# EAGLE design TestBed (EAGLE 6.5.0)
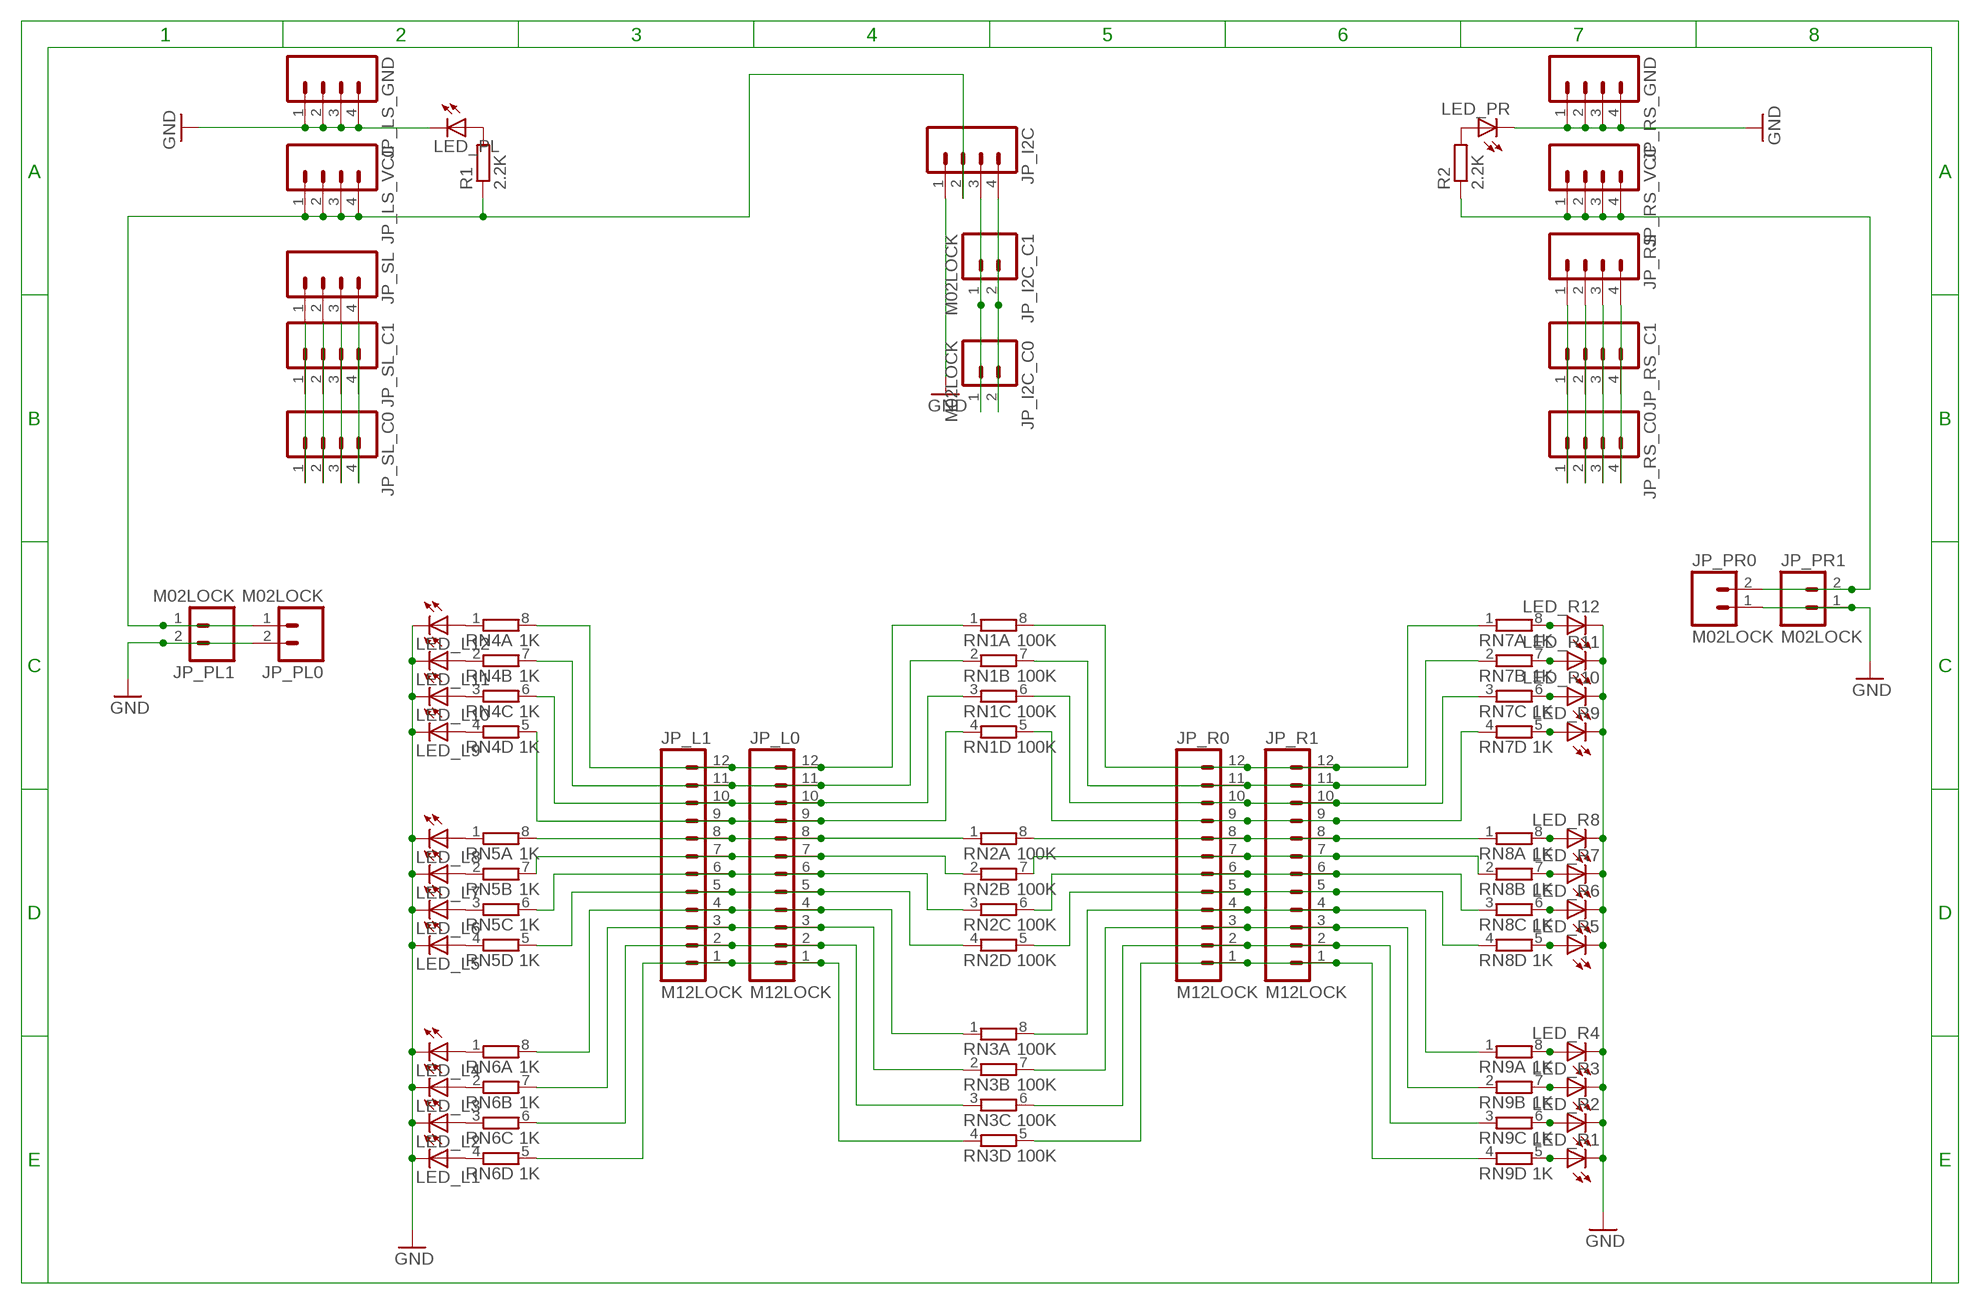
[diagram p0: schematic, sheet 1]

## Parts
JP_I2C  M04LOCK  [1X04_LOCK]
JP_I2C_C0  M02LOCK  [1X02_LOCK]
JP_I2C_C1  M02LOCK  [1X02_LOCK]
JP_L0  M12LOCK  [1X12_LOCK]
JP_L1  M12LOCK  [1X12_LOCK]
JP_LS_GND  M04LOCK  [1X04_LOCK]
JP_LS_VCC  M04LOCK  [1X04_LOCK]
JP_PL0  M02LOCK  [1X02_LOCK]
JP_PL1  M02LOCK  [1X02_LOCK]
JP_PR0  M02LOCK  [1X02_LOCK]
JP_PR1  M02LOCK  [1X02_LOCK]
JP_R0  M12LOCK  [1X12_LOCK]
JP_R1  M12LOCK  [1X12_LOCK]
JP_RS  M04LOCK  [1X04_LOCK]
JP_RS_C0  M04LOCK  [1X04_LOCK]
JP_RS_C1  M04LOCK  [1X04_LOCK]
JP_RS_GND  M04LOCK  [1X04_LOCK]
JP_RS_VCC  M04LOCK  [1X04_LOCK]
JP_SL  M04LOCK  [1X04_LOCK]
JP_SL_C0  M04LOCK  [1X04_LOCK]
JP_SL_C1  M04LOCK  [1X04_LOCK]
LED_L1  LEDCHIP-LED0805  [CHIP-LED0805]
LED_L2  LEDCHIP-LED0805  [CHIP-LED0805]
LED_L3  LEDCHIP-LED0805  [CHIP-LED0805]
LED_L4  LEDCHIP-LED0805  [CHIP-LED0805]
LED_L5  LEDCHIP-LED0805  [CHIP-LED0805]
LED_L6  LEDCHIP-LED0805  [CHIP-LED0805]
LED_L7  LEDCHIP-LED0805  [CHIP-LED0805]
LED_L8  LEDCHIP-LED0805  [CHIP-LED0805]
LED_L9  LEDCHIP-LED0805  [CHIP-LED0805]
LED_L10  LEDCHIP-LED0805  [CHIP-LED0805]
LED_L11  LEDCHIP-LED0805  [CHIP-LED0805]
LED_L12  LEDCHIP-LED0805  [CHIP-LED0805]
LED_PL  LEDCHIP-LED0805  [CHIP-LED0805]
LED_PR  LEDCHIP-LED0805  [CHIP-LED0805]
LED_R1  LEDCHIP-LED0805  [CHIP-LED0805]
LED_R2  LEDCHIP-LED0805  [CHIP-LED0805]
LED_R3  LEDCHIP-LED0805  [CHIP-LED0805]
LED_R4  LEDCHIP-LED0805  [CHIP-LED0805]
LED_R5  LEDCHIP-LED0805  [CHIP-LED0805]
LED_R6  LEDCHIP-LED0805  [CHIP-LED0805]
LED_R7  LEDCHIP-LED0805  [CHIP-LED0805]
LED_R8  LEDCHIP-LED0805  [CHIP-LED0805]
LED_R9  LEDCHIP-LED0805  [CHIP-LED0805]
LED_R10  LEDCHIP-LED0805  [CHIP-LED0805]
LED_R11  LEDCHIP-LED0805  [CHIP-LED0805]
LED_R12  LEDCHIP-LED0805  [CHIP-LED0805]
R1  2.2K  R-EU_M0805  [M0805]
R2  2.2K  R-EU_M0805  [M0805]
RN1  100K  4R-NEXBS8V  [EXBS8V]
RN2  100K  4R-NEXBS8V  [EXBS8V]
RN3  100K  4R-NEXBS8V  [EXBS8V]
RN4  1K  4R-NEXBS8V  [EXBS8V]
RN5  1K  4R-NEXBS8V  [EXBS8V]
RN6  1K  4R-NEXBS8V  [EXBS8V]
RN7  1K  4R-NEXBS8V  [EXBS8V]
RN8  1K  4R-NEXBS8V  [EXBS8V]
RN9  1K  4R-NEXBS8V  [EXBS8V]

## Nets
GND [pwr]: JP_I2C.1 JP_LS_GND.1 JP_LS_GND.2 JP_LS_GND.3 JP_LS_GND.4 JP_PL0.2 JP_PL1.2 JP_PR0.1 JP_PR1.1 JP_RS_GND.1 JP_RS_GND.2 JP_RS_GND.3 JP_RS_GND.4 LED_L1.C LED_L2.C LED_L3.C LED_L4.C LED_L5.C LED_L6.C LED_L7.C LED_L8.C LED_L9.C LED_L10.C LED_L11.C LED_L12.C LED_PL.C LED_PR.C LED_R1.C LED_R2.C LED_R3.C LED_R4.C LED_R5.C LED_R6.C LED_R7.C LED_R8.C LED_R9.C LED_R10.C LED_R11.C LED_R12.C
N$1: LED_L1.A RN6.4
N$2: LED_L2.A RN6.3
N$3: LED_L3.A RN6.2
N$4: LED_L4.A RN6.1
N$5: LED_L5.A RN5.4
N$6: LED_L6.A RN5.3
N$7: LED_L7.A RN5.2
N$8: LED_L8.A RN5.1
N$9: LED_L9.A RN4.4
N$10: LED_L10.A RN4.3
N$11: LED_L11.A RN4.2
N$12: LED_L12.A RN4.1
N$13: LED_R12.A RN7.8
N$14: LED_R11.A RN7.7
N$15: LED_R10.A RN7.6
N$16: LED_R9.A RN7.5
N$17: LED_R8.A RN8.8
N$18: LED_R7.A RN8.7
N$19: LED_R6.A RN8.6
N$20: LED_R5.A RN8.5
N$21: LED_R4.A RN9.8
N$22: LED_R3.A RN9.7
N$23: LED_R2.A RN9.6
N$24: LED_R1.A RN9.5
N$25: JP_L0.2 JP_L1.2 RN3.3 RN6.6
N$26: JP_L0.3 JP_L1.3 RN3.2 RN6.7
N$27: JP_L0.1 JP_L1.1 RN3.4 RN6.5
N$29: JP_L0.5 JP_L1.5 RN2.4 RN5.5
N$30: JP_L0.6 JP_L1.6 RN2.3 RN5.6
N$31: JP_L0.7 JP_L1.7 RN2.2 RN5.7
N$32: JP_L0.8 JP_L1.8 RN2.1 RN5.8
N$33: JP_L0.9 JP_L1.9 RN1.4 RN4.5
N$34: JP_R0.12 JP_R1.12 RN1.8 RN7.1
N$35: JP_L0.11 JP_L1.11 RN1.2 RN4.7
N$37: JP_R0.1 JP_R1.1 RN3.5 RN9.4
N$38: JP_R0.2 JP_R1.2 RN3.6 RN9.3
N$39: JP_R0.3 JP_R1.3 RN3.7 RN9.2
N$40: JP_R0.4 JP_R1.4 RN3.8 RN9.1
N$41: JP_R0.5 JP_R1.5 RN2.5 RN8.4
N$42: JP_R0.7 JP_R1.7 RN2.7 RN8.2
N$43: JP_SL.1 JP_SL_C0.1 JP_SL_C1.1
N$44: JP_R0.8 JP_R1.8 RN2.8 RN8.1
N$45: JP_R0.9 JP_R1.9 RN1.5 RN7.4
N$46: JP_R0.10 JP_R1.10 RN1.6 RN7.3
N$47: JP_R0.11 JP_R1.11 RN1.7 RN7.2
N$48: JP_SL.2 JP_SL_C0.2 JP_SL_C1.2
N$49: JP_L0.12 JP_L1.12 RN1.1 RN4.8
N$50: JP_SL.3 JP_SL_C0.3 JP_SL_C1.3
N$51: JP_SL.4 JP_SL_C0.4 JP_SL_C1.4
N$52: JP_L0.4 JP_L1.4 RN3.1 RN6.8
N$55: JP_RS.1 JP_RS_C0.1 JP_RS_C1.1
N$56: JP_RS.2 JP_RS_C0.2 JP_RS_C1.2
N$57: JP_RS.3 JP_RS_C0.3 JP_RS_C1.3
N$58: JP_L0.10 JP_L1.10 RN1.3 RN4.6
N$59: JP_RS.4 JP_RS_C0.4 JP_RS_C1.4
N$60: LED_PL.A R1.2
N$61: LED_PR.A R2.2
N$64: JP_R0.6 JP_R1.6 RN2.6 RN8.3
SCL: JP_I2C.4 JP_I2C_C0.2 JP_I2C_C1.2
SDA: JP_I2C.3 JP_I2C_C0.1 JP_I2C_C1.1
VCC_L [pwr]: JP_I2C.2 JP_LS_VCC.1 JP_LS_VCC.2 JP_LS_VCC.3 JP_LS_VCC.4 JP_PL0.1 JP_PL1.1 R1.1
VCC_R [pwr]: JP_PR0.2 JP_PR1.2 JP_RS_VCC.1 JP_RS_VCC.2 JP_RS_VCC.3 JP_RS_VCC.4 R2.1

## Library data of the parts
JP_I2C JP_LS_GND JP_LS_VCC JP_RS JP_RS_C0 JP_RS_C1 JP_RS_GND JP_RS_VCC JP_SL JP_SL_C0 JP_SL_C1 = SparkFun-Connectors:M04: Header 4 Standard 4-pin 0.1" header. Use with straight break away headers (SKU : PRT-00116), right angle break away headers (PRT-00553), swiss pins (PRT-00743), machine pins (PRT-00117), and female headers (PRT-00115). Molex polarized connector foot print use with SKU : PRT-08231 with associated crimp pins and housings. 1MM SMD Version SKU: PRT-10208
JP_I2C_C0 JP_I2C_C1 JP_PL0 JP_PL1 JP_PR0 JP_PR1 = SparkFun-Connectors:M02: Standard 2-pin 0.1" header. Use with - straight break away headers ( PRT-00116) - right angle break away headers (PRT-00553) - swiss pins (PRT-00743) - machine pins (PRT-00117) - female headers (PRT-00115) Molex polarized connector foot print use with: PRT-08233 with associated crimp pins and housings. 2.54_SCREWTERM for use with PRT-10571. 3.5mm Screw Terminal footprints for PRT-08084 5mm Screw Terminal footprints for use with PRT-08433
JP_L0 JP_L1 JP_R0 JP_R1 = SparkFun-Connectors:M12: Header 12 Standard 12-pin 0.1" header. Use with straight break away headers (SKU : PRT-00116), right angle break away headers (PRT-00553), swiss pins (PRT-00743), machine pins (PRT-00117), and female headers (PRT-00115).
LED_L1-LED_L12 LED_PL LED_PR LED_R1-LED_R12 = led:LED: LED OSRAM: - CHIPLED LG R971, LG N971, LY N971, LG Q971, LY Q971, LO R971, LY R971 LH N974, LH R974 LS Q976, LO Q976, LY Q976 LO Q996 - Hyper CHIPLED LW Q18S LB Q993, LB Q99A, LB R99A - SideLED LS A670, LO A670, LY A670, LG A670, LP A670 LB A673, LV A673, LT A673, LW A673 LH A674 LY A675 LS A676, LA A676, LO A676, LY A676, LW A676 LS A679, LY A679, LG A679 - Hyper Micro SIDELED® LS Y876, LA Y876, LO Y876, LY Y876 LT Y87S - SmartLED LW L88C, LW L88S LB L89C, LB L89S, LG L890 LS L89K, LO L89K, LY L89K LS L896, LA L896, LO L896, LY L896 - TOPLED LS T670, LO T670, LY T670, LG T670, LP T670 LSG T670, LSP T670, LSY T670, LOP T670, LYG T670 LG T671, LOG T671, LSG T671 LB T673, LV T673, LT T673, LW T673 LH T674 LS T676, LA T676, LO T676, LY T676, LB T676, LH T676, LSB T676, LW T676 LB T67C, LV T67C, LT T67C, LS T67K, LO T67K, LY T67K, LW E67C LS E67B, LA E67B, LO E67B, LY E67B, LB E67C, LV E67C, LT E67C LW T67C LS T679, LY T679, LG T679 LS T770, LO T770, LY T770, LG T770, LP T770 LB T773, LV T773, LT T773, LW T773 LH T774 LS E675, LA E675, LY E675, LS T675 LS T776, LA T776, LO T776, LY T776, LB T776 LHGB T686 LT T68C, LB T68C - Hyper Mini TOPLED® LB M676 - Mini TOPLED Santana® LG M470 LS M47K, LO M47K, LY M47K Source: http://www.osram.convergy.de LUXEON: - LUMILED® LXK2-PW12-R00, LXK2-PW12-S00, LXK2-PW14-U00, LXK2-PW14-V00 LXK2-PM12-R00, LXK2-PM12-S00, LXK2-PM14-U00 LXK2-PE12-Q00, LXK2-PE12-R00, LXK2-PE12-S00, LXK2-PE14-T00, LXK2-PE14-U00 LXK2-PB12-K00, LXK2-PB12-L00, LXK2-PB12-M00, LXK2-PB14-N00, LXK2-PB14-P00, LXK2-PB14-Q00 LXK2-PR12-L00, LXK2-PR12-M00, LXK2-PR14-Q00, LXK2-PR14-R00 LXK2-PD12-Q00, LXK2-PD12-R00, LXK2-PD12-S00 LXK2-PH12-R00, LXK2-PH12-S00 LXK2-PL12-P00, LXK2-PL12-Q00, LXK2-PL12-R00 Source: www.luxeon.com KINGBRIGHT: KA-3528ASYC Source: www.kingbright.com
R1 R2 = resistor:R-EU_: RESISTOR, European symbol
RN1-RN9 = resistor-dil:4R-N: Array Chip Resistor Source: RS Component / Phycomp; OC_FARNELL: unknown; OC_NEWARK: unknown

## Net classes
0 default: width 0.305 mm, drill 0.406 mm, clearance 0.305 mm
1 pwr: width 1.016 mm, drill 0.406 mm, clearance 0.406 mm

## Board
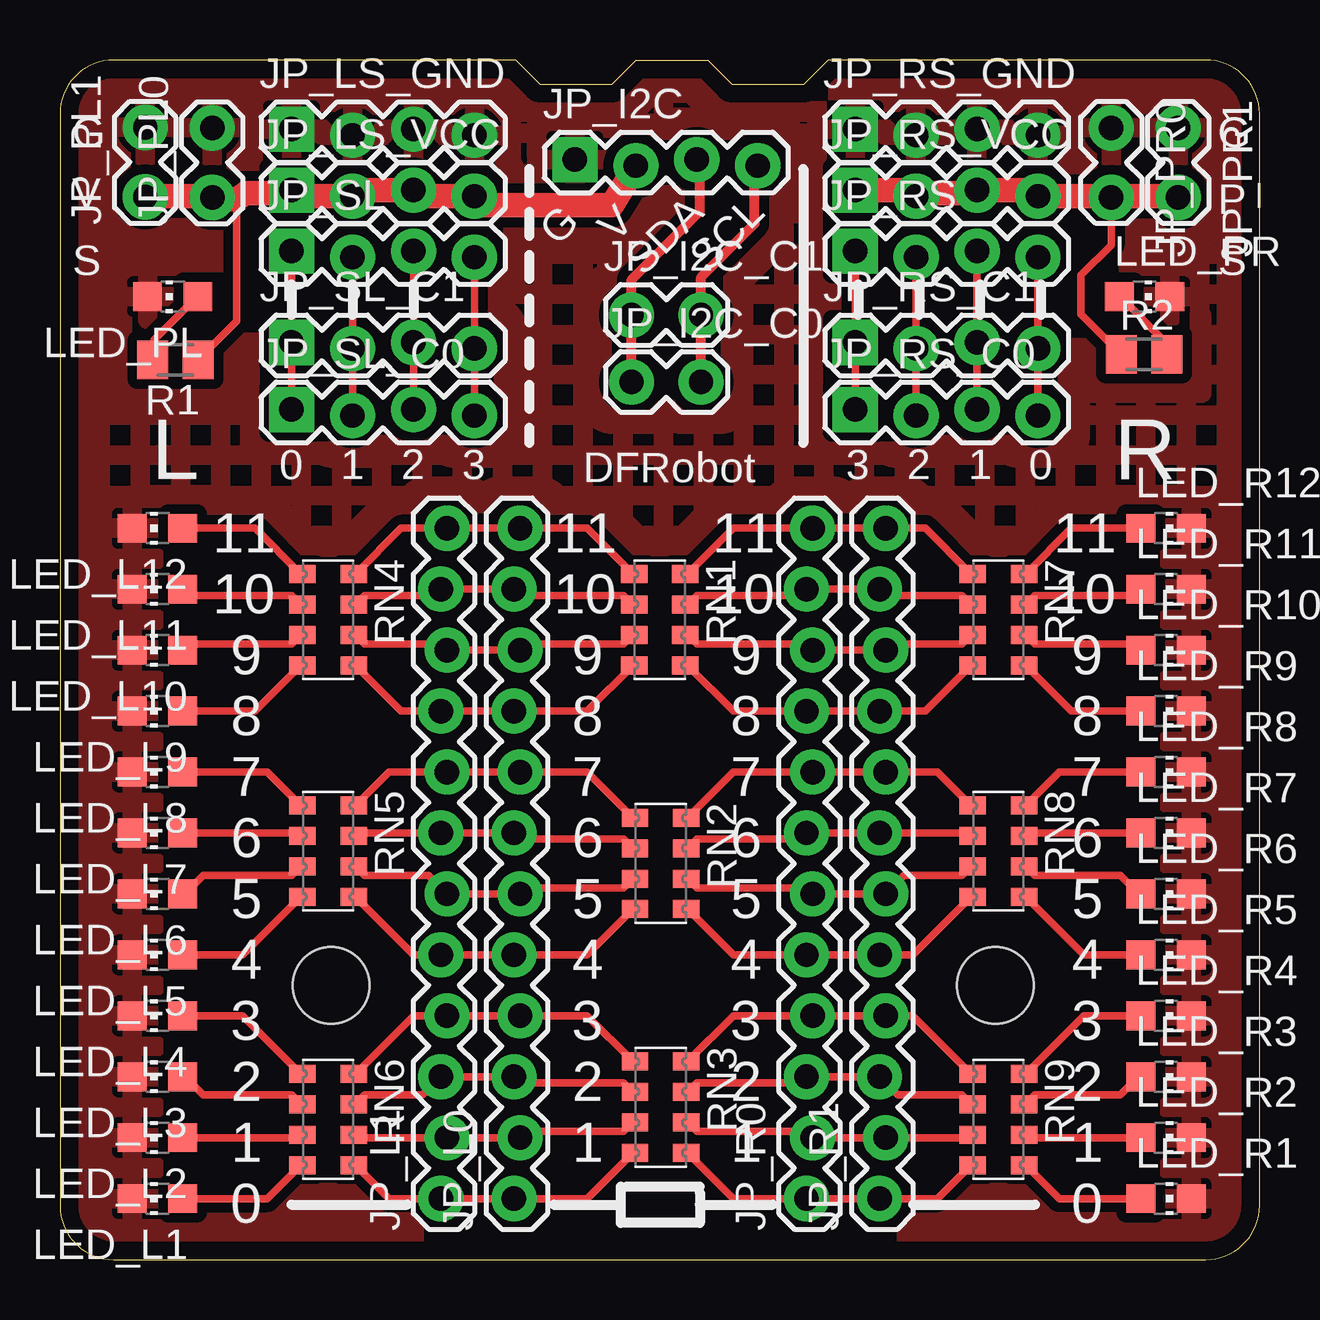
[diagram p1: board, top side]
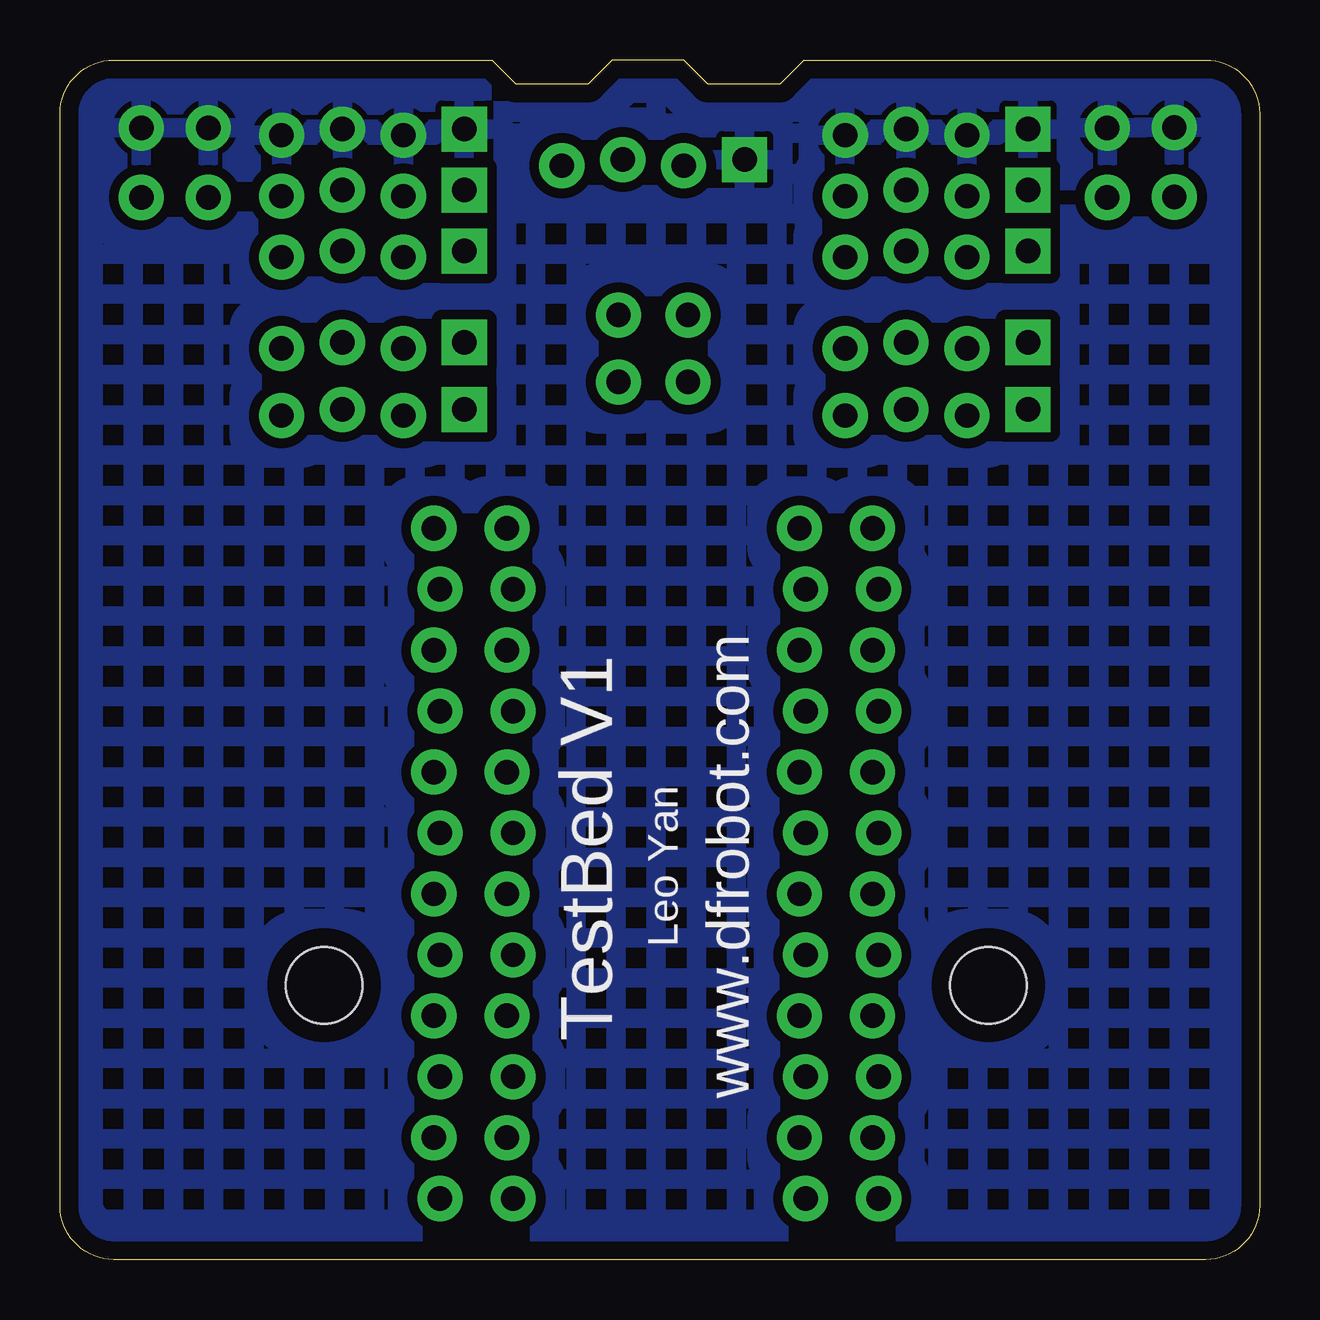
[diagram p2: board, bottom side, seen from below]

Size 50 x 50 mm. Coordinates in mm from the lower left corner, seen from the top.
Outline: 0,47.76 0,2.24 arc90 2.24,0 47.76,0 arc90 50,2.24 50,47.76 arc90 47.76,50 32,50 31,49 28,49 27,50 24,50 23,49 20,49 19,50 2.24,50 arc90 0,47.76
Copper layers (1*16): Top 0.035mm / dielectric 1.5mm / Bottom 0.035mm
Design rules: minimum track width 10mil, minimum drill 14mil, track to track 8mil, track to pad 8mil, pad to pad 8mil, via to via 8mil, smd to smd 8mil, copper to edge 30mil, drill to drill 8mil, minimum pad ring 10mil, minimum via ring 8mil, stop-mask expansion 4mil, vias tented up to drill 0mil, thermal gap 10mil
Holes 3.2 mm at 11.3,11.43 38.99,11.43

### Footprints (pad centres in the part's own frame; a part is rotated, then mirrored left to right if it is on the bottom)
1X04_LOCK = drill 1.016 pad 1.88 square: 1 0,0.127 | drill 1.016 pad 1.88: 2 2.54,-0.127; 3 5.08,0.127; 4 7.62,-0.127
1X02_LOCK = drill 1.016 pad 1.88: 1 -0.178,0; 2 2.718,0
1X12_LOCK = drill 1.016 pad 1.88: 1 0,0.127; 2 2.54,-0.127; 3 5.08,0.127; 4 7.62,-0.127; 5 10.16,0.127; 6 12.7,-0.127; 7 15.24,0.127; 8 17.78,-0.127; 9 20.32,0.127; 10 22.86,-0.127; 11 25.4,0.127; 12 27.94,-0.127
CHIP-LED0805 = smd 1.2 x 1.2: A 0,-1.05; C 0,1.05
M0805 = smd 1.3 x 1.6: 1 -0.95,0; 2 0.95,0
EXBS8V = smd 0.75 x 1.1: 1 -1.905,-1.07; 2 -0.635,-1.07; 3 0.635,-1.07; 4 1.905,-1.07; 5 1.905,1.07; 6 0.635,1.07; 7 -0.635,1.07; 8 -1.905,1.07

### Placement (x,y rotation side)
JP_I2C  21.46,45.72 0 top
JP_I2C_C0  24,36.58 0 top
JP_I2C_C1  24,39.37 0 top
JP_L0  19.05,2.54 90 top
JP_L1  16,2.54 90 top
JP_LS_GND  9.65,46.99 0 top
JP_LS_VCC  9.65,44.45 0 top
JP_PL0  6.35,44.45 90 top
JP_PL1  3.55,44.47 90 top
JP_PR0  43.81,46.99 270 top
JP_PR1  46.61,46.99 270 top
JP_R0  31.24,2.54 90 top
JP_R1  34.29,2.54 90 top
JP_RS  33.15,41.91 0 top
JP_RS_C0  33.15,35.31 0 top
JP_RS_C1  33.15,38.1 0 top
JP_RS_GND  33.15,46.99 0 top
JP_RS_VCC  33.15,44.45 0 top
JP_SL  9.65,41.91 0 top
JP_SL_C0  9.65,35.31 0 top
JP_SL_C1  9.65,38.1 0 top
LED_L1  4.06,2.54 90 top
LED_L2  4.06,5.08 90 top
LED_L3  4.06,7.62 90 top
LED_L4  4.06,10.16 90 top
LED_L5  4.06,12.7 90 top
LED_L6  4.06,15.24 90 top
LED_L7  4.06,17.78 90 top
LED_L8  4.06,20.32 90 top
LED_L9  4.06,22.86 90 top
LED_L10  4.06,25.4 90 top
LED_L11  4.06,27.94 90 top
LED_L12  4.06,30.48 90 top
LED_PL  4.7,40.13 90 top
LED_PR  45.21,40.13 270 top
LED_R1  46.1,2.54 270 top
LED_R2  46.1,5.08 270 top
LED_R3  46.1,7.62 270 top
LED_R4  46.1,10.16 270 top
LED_R5  46.1,12.7 270 top
LED_R6  46.1,15.24 270 top
LED_R7  46.1,17.78 270 top
LED_R8  46.1,20.32 270 top
LED_R9  46.1,22.86 270 top
LED_R10  46.1,25.4 270 top
LED_R11  46.1,27.94 270 top
LED_R12  46.1,30.48 270 top
R1  4.81,37.49 180 top
R2  45.19,37.72 0 top
RN1  25,26.67 270 top
RN2  25.04,16.51 270 top
RN3  25.04,6.35 270 top
RN4  11.18,26.67 270 top
RN5  11.18,17.02 270 top
RN6  11.18,5.84 270 top
RN7  39.12,26.67 270 top
RN8  39.12,17.02 270 top
RN9  39.12,5.84 270 top

### Tracks (layer width: path | path; a pad name or v marks a point on that pad's centre or on a via)
GND
  pour Top (hatched): 0,50 0,0 50,0 50,50
  pour Bottom (hatched): 0,50 0,0 50,0 50,50
N$1
  Top 0.305: LED_L1.A 8.64,2.54 10.03,3.94 RN6.4
N$2
  Top 0.305: LED_L2.A 9.91,5.08 10.03,5.21 RN6.3
N$3
  Top 0.305: RN6.2 10.03,6.48 9.65,6.86 5.97,6.86 5.21,7.62 LED_L3.A
N$4
  Top 0.305: LED_L4.A 7.62,10.16 10.03,7.75 RN6.1
N$5
  Top 0.305: LED_L5.A 7.62,12.7 10.03,15.11 RN5.4
N$6
  Top 0.305: RN5.3 10.03,16.38 9.65,16 5.97,16 5.21,15.24 LED_L6.A
N$7
  Top 0.305: LED_L7.A 9.91,17.78 10.03,17.65 RN5.2
N$8
  Top 0.305: LED_L8.A 8.64,20.32 10.03,18.92 RN5.1
N$9
  Top 0.305: LED_L9.A 8.13,22.86 10.03,24.77 RN4.4
N$10
  Top 0.305: RN4.3 10.03,26.04 9.65,25.65 5.46,25.65 5.21,25.4 LED_L10.A
N$11
  Top 0.305: RN4.2 10.03,27.3 9.65,27.69 5.46,27.69 5.21,27.94 LED_L11.A
N$12
  Top 0.305: LED_L12.A 8.13,30.48 10.03,28.57 RN4.1
N$13
  Top 0.305: LED_R12.A 42.16,30.48 40.26,28.57 RN7.8
N$14
  Top 0.305: RN7.7 40.26,27.3 40.64,27.69 44.7,27.69 44.96,27.94 LED_R11.A
N$15
  Top 0.305: RN7.6 40.26,26.04 40.64,25.65 44.7,25.65 44.96,25.4 LED_R10.A
N$16
  Top 0.305: LED_R9.A 42.16,22.86 40.26,24.77 RN7.5
N$17
  Top 0.305: LED_R8.A 41.66,20.32 40.26,18.92 RN8.8
N$18
  Top 0.305: LED_R7.A 40.39,17.78 40.26,17.65 RN8.7
N$19
  Top 0.305: RN8.6 40.26,16.38 40.64,16 44.2,16 44.96,15.24 LED_R6.A
N$20
  Top 0.305: LED_R5.A 42.67,12.7 40.26,15.11 RN8.5
N$21
  Top 0.305: LED_R4.A 42.67,10.16 40.26,7.75 RN9.8
N$22
  Top 0.305: RN9.7 40.26,6.48 40.64,6.86 44.2,6.86 44.96,7.62 LED_R3.A
N$23
  Top 0.305: LED_R2.A 40.39,5.08 40.26,5.21 RN9.6
N$24
  Top 0.305: LED_R1.A 41.66,2.54 40.26,3.94 RN9.5
N$25
  Top 0.305: RN6.6 12.32,5.21 12.45,5.08 JP_L1.2 JP_L0.2 19.43,5.33 23.5,5.33 23.88,5.71 RN3.3
N$26
  Top 0.305: RN6.7 12.32,6.48 12.7,6.86 15.11,6.86 JP_L1.3 JP_L0.3 19.18,7.37 23.5,7.37 23.88,6.99 RN3.2
N$27
  Top 0.305: RN6.5 12.32,3.94 13.72,2.54 JP_L1.1 JP_L0.1 21.97,2.54 23.88,4.45 RN3.4
N$29
  Top 0.305: RN5.5 12.32,15.11 14.73,12.7 JP_L1.5 JP_L0.5 21.97,12.7 23.88,14.61 RN2.4
N$30
  Top 0.305: RN5.6 12.32,16.38 12.7,16 15.37,16 JP_L1.6 JP_L0.6 19.43,15.49 23.5,15.49 23.88,15.88 RN2.3
N$31
  Top 0.305: RN5.7 12.32,17.65 12.45,17.78 JP_L1.7 JP_L0.7 19.18,17.53 23.5,17.53 23.88,17.14 RN2.2
N$32
  Top 0.305: RN5.8 12.32,18.92 13.72,20.32 JP_L1.8 JP_L0.8 21.97,20.32 23.88,18.41 RN2.1
N$33
  Top 0.305: RN4.5 12.32,24.77 14.22,22.86 JP_L1.9 JP_L0.9 21.97,22.86 23.88,24.77 RN1.4
N$34
  Top 0.305: RN7.1 37.97,28.57 36.07,30.48 JP_R1.12 JP_R0.12 28.07,30.48 26.16,28.57 RN1.8
N$35
  Top 0.305: RN4.7 12.32,27.3 12.7,27.69 15.62,27.69 JP_L1.11 JP_L0.11 19.18,27.69 23.5,27.69 23.88,27.3 RN1.2
N$37
  Top 0.305: RN9.4 37.97,3.94 36.58,2.54 JP_R1.1 JP_R0.1 28.07,2.54 26.16,4.45 RN3.5
N$38
  Top 0.305: RN9.3 37.97,5.21 37.85,5.08 JP_R1.2 JP_R0.2 31.11,5.33 26.54,5.33 26.16,5.71 RN3.6
N$39
  Top 0.305: RN9.2 37.97,6.48 37.59,6.86 34.92,6.86 JP_R1.3 JP_R0.3 30.86,7.37 26.54,7.37 26.16,6.99 RN3.7
N$40
  Top 0.305: RN9.1 37.97,7.75 35.56,10.16 JP_R1.4 JP_R0.4 28.07,10.16 26.16,8.26 RN3.8
N$41
  Top 0.305: RN8.4 37.97,15.11 35.56,12.7 JP_R1.5 JP_R0.5 28.07,12.7 26.16,14.61 RN2.5
N$42
  Top 0.305: RN8.2 37.97,17.65 37.85,17.78 JP_R1.7 JP_R0.7 30.86,17.53 26.54,17.53 26.16,17.14 RN2.7
N$43
  Top 0.305: JP_SL_C0.1 JP_SL_C1.1 JP_SL.1
N$44
  Top 0.305: RN8.1 37.97,18.92 36.58,20.32 JP_R1.8 JP_R0.8 28.07,20.32 26.16,18.41 RN2.8
N$45
  Top 0.305: RN7.4 37.97,24.77 36.07,22.86 JP_R1.9 JP_R0.9 28.07,22.86 26.16,24.77 RN1.5
N$46
  Top 0.305: RN7.3 37.97,26.04 37.59,25.65 34.67,25.65 JP_R1.10 JP_R0.10 31.11,25.65 26.54,25.65 26.16,26.04 RN1.6
N$47
  Top 0.305: RN7.2 37.97,27.3 37.59,27.69 34.42,27.69 JP_R1.11 JP_R0.11 30.86,27.69 26.54,27.69 26.16,27.3 RN1.7
N$48
  Top 0.305: JP_SL_C0.2 JP_SL_C1.2 JP_SL.2
N$49
  Top 0.305: RN4.8 12.32,28.57 14.22,30.48 JP_L1.12 JP_L0.12 21.97,30.48 23.88,28.57 RN1.1
N$50
  Top 0.305: JP_SL_C0.3 JP_SL_C1.3 JP_SL.3
N$51
  Top 0.305: JP_SL_C0.4 JP_SL_C1.4 JP_SL.4
N$52
  Top 0.305: RN6.8 12.32,7.75 14.73,10.16 JP_L1.4 JP_L0.4 21.97,10.16 23.88,8.26 RN3.1
N$55
  Top 0.305: JP_RS_C0.1 JP_RS_C1.1 JP_RS.1
N$56
  Top 0.305: JP_RS_C0.2 JP_RS_C1.2 JP_RS.2
N$57
  Top 0.305: JP_RS_C0.3 JP_RS_C1.3 JP_RS.3
N$58
  Top 0.305: RN4.6 12.32,26.04 12.7,25.65 15.88,25.65 JP_L1.10 JP_L0.10 19.43,25.65 23.5,25.65 23.88,26.04 RN1.3
N$59
  Top 0.305: JP_RS_C0.4 JP_RS_C1.4 JP_RS.4
N$60
  Top 0.305: LED_PL.A 5.71,40.13 3.94,38.35 3.94,37.59 R1.2
N$61
  Top 0.305: LED_PR.A 44.2,40.13 46.1,38.23 46.1,37.85 R2.2
N$64
  Top 0.305: RN8.3 37.97,16.38 37.59,16 35.18,16 JP_R1.6 JP_R0.6 31.11,15.49 26.54,15.49 26.16,15.88 RN2.6
SCL
  Top 0.406: JP_I2C_C0.2 JP_I2C_C1.2 26.72,40.95 28.96,43.18 28.96,45.47 JP_I2C.4
SDA
  Top 0.406: JP_I2C_C0.1 JP_I2C_C1.1 23.82,40.84 26.67,43.69 26.67,45.72 JP_I2C.3
VCC_L
  Top 0.305: 5.84,37.59 7.37,39.12 7.37,44.2
  Top 1.016: 5.84,37.59 R1.1 | JP_PL1.1 3.56,44.32 5.97,44.32 JP_PL0.1 6.35,44.2 7.37,44.2 7.75,44.45 9.53,44.45 JP_LS_VCC.1 10.03,44.32 JP_LS_VCC.2 12.57,44.58 JP_LS_VCC.3 15.11,44.32 JP_LS_VCC.4 17.53,43.94 23,43.94 JP_I2C.2
VCC_R
  Top 0.305: JP_PR0.2 43.81,42.29 42.55,41.02 42.55,39.41 R2.1
  Top 1.016: 44.2,37.85 R2.1 | JP_PR1.2 46.61,44.32 44.2,44.32 JP_PR0.2 43.31,44.32 JP_RS_VCC.4 40.51,44.58 JP_RS_VCC.3 37.85,44.45 36.07,44.45 JP_RS_VCC.2 35.43,44.58 JP_RS_VCC.1

### Text on the board
tPlace: G | G | V | G | V | SDA | SCL | P | S | S | L | 0 | 1 | 2 | 3 | DFRobot | 3 | 2 | 1 | 0 | R | 11 | 11 | 11 | 11 | 10 | 10 | 10 | 10 | 9 | 9 | 9 | 9 | 8 | 8 | 8 | 8 | 7 | 7 | 7 | 7 | 6 | 6 | 6 | 6 | 5 | 5 | 5 | 5 | 4 | 4 | 4 | 4 | 3 | 3 | 3 | 3 | 2 | 2 | 2 | 2 | 1 | 1 | 1 | 1 | 0 | 0
bPlace: TestBed V1 | www.dfrobot.com | Leo Yan